# Altium schematic sheet BlockDiagram.SchDoc
size A3; SheetNumber: 1; SheetTotal: 3
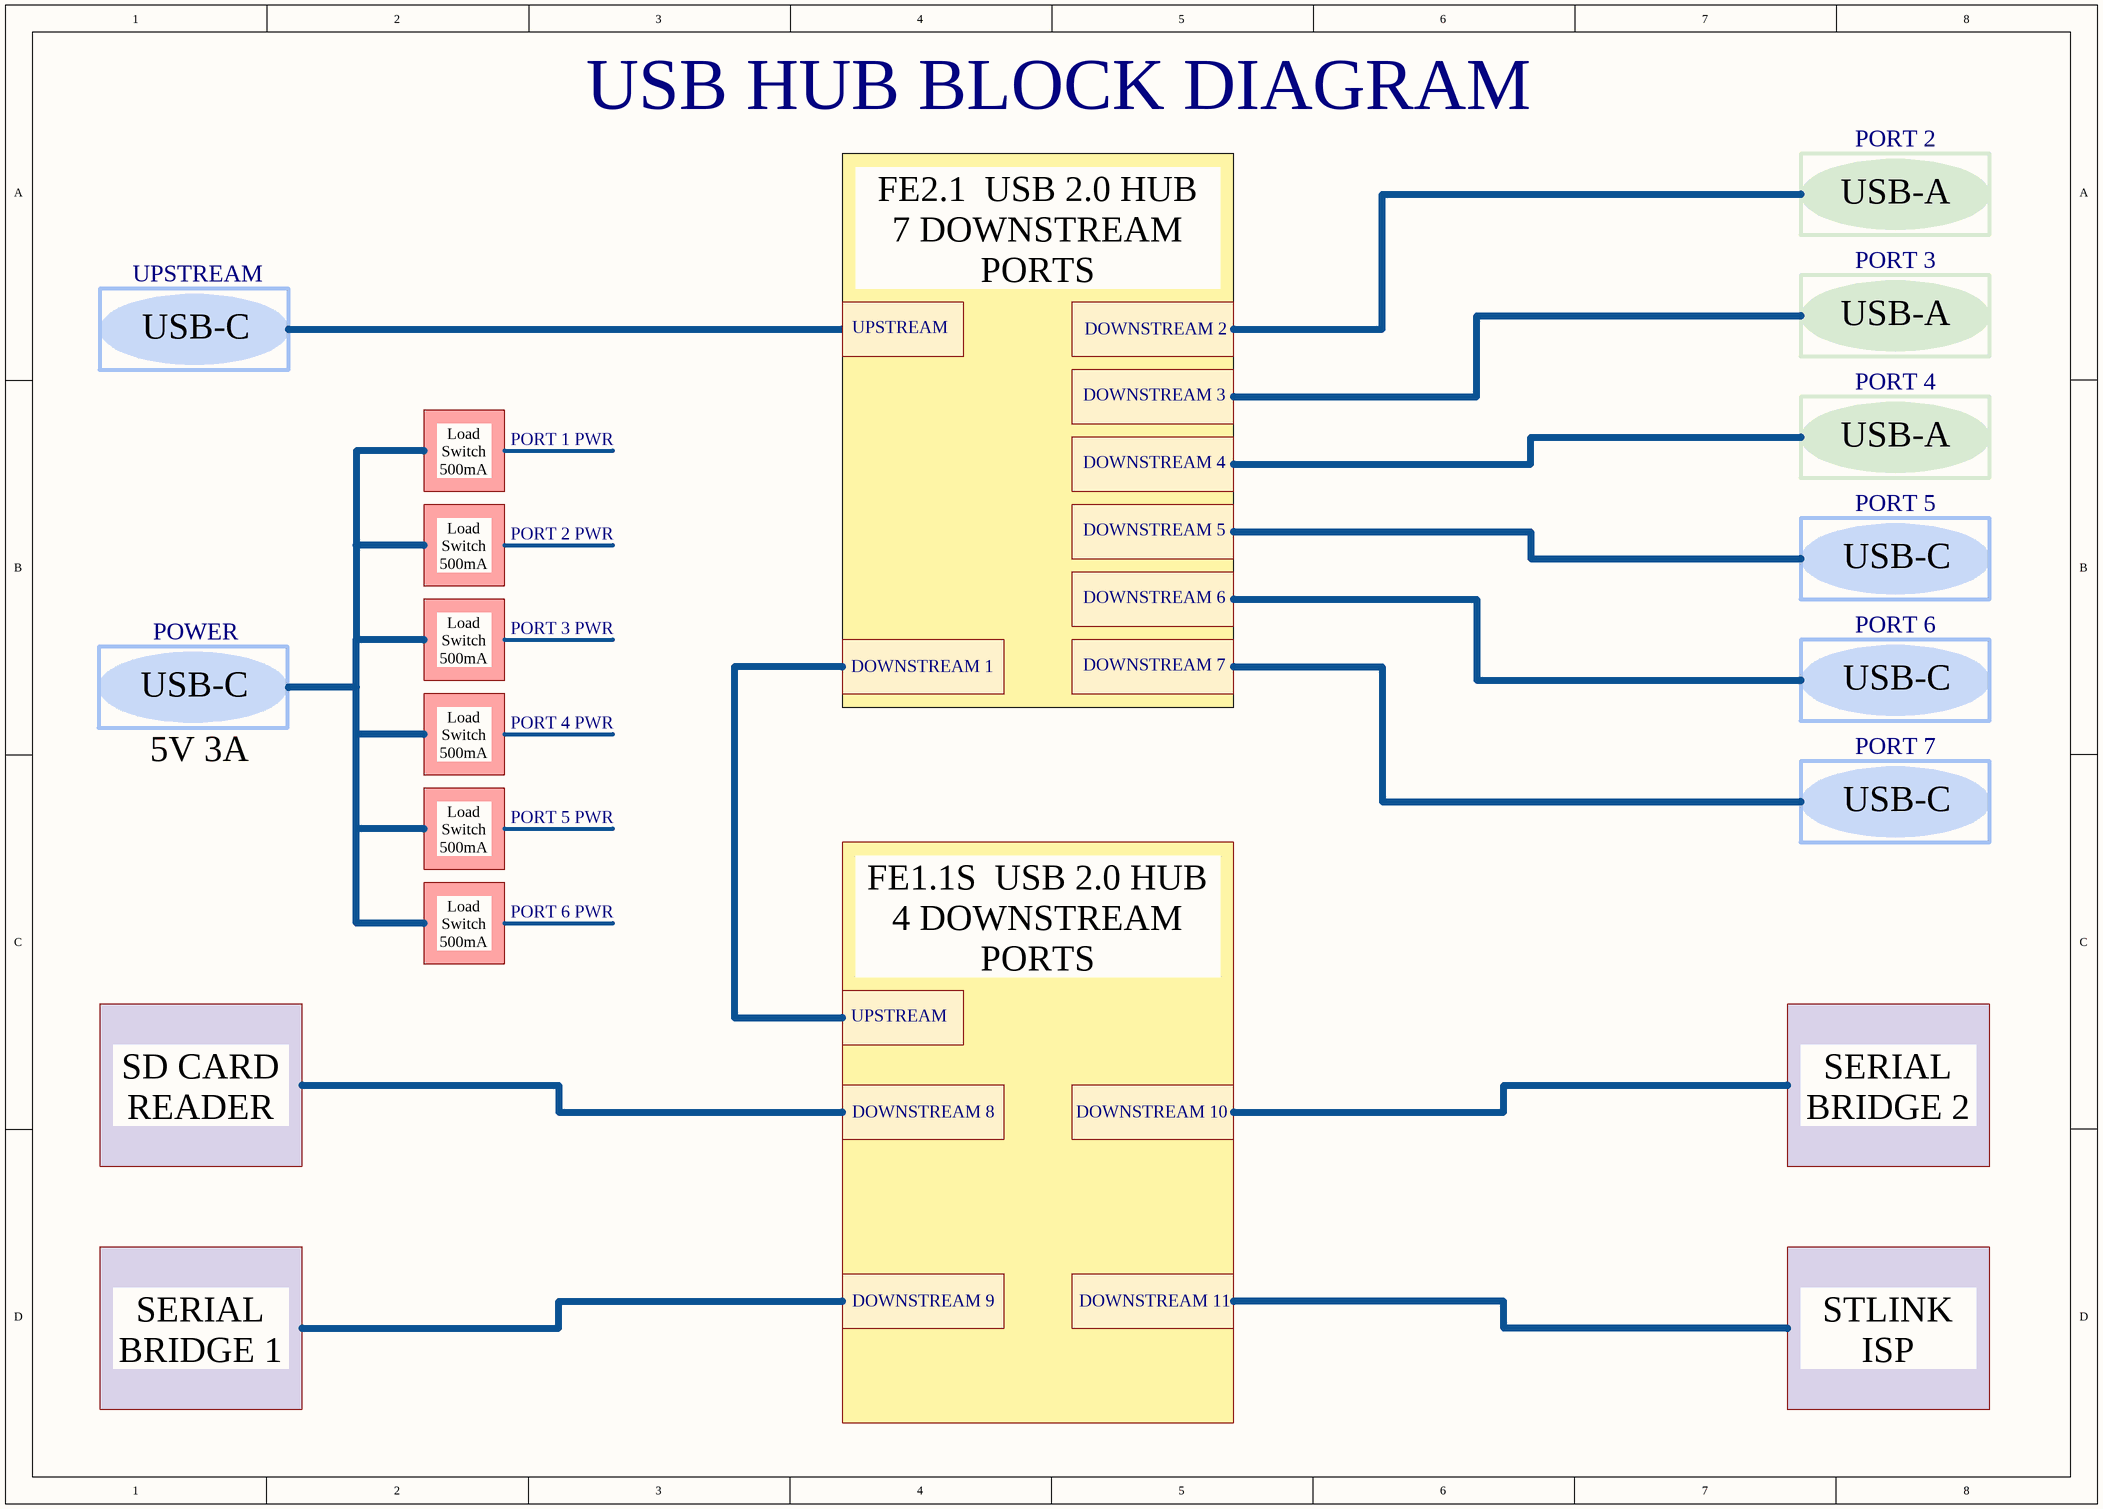
[diagram p0: BlockDiagram.SchDoc]

## Notes on the sheet
- USB HUB BLOCK DIAGRAM
- PORT 2
- USB-A
- UPSTREAM
- FE2.1  USB 2.0 HUB
  7 DOWNSTREAM
  PORTS
- PORT 3
- USB-C
- DOWNSTREAM 2
- PORT 1 PWR
- DOWNSTREAM 3
- PORT 4
- Load Switch
  500mA
- DOWNSTREAM 4
- PORT 5
- PORT 2 PWR
- DOWNSTREAM 5
- POWER
- PORT 3 PWR
- DOWNSTREAM 6
- PORT 6
- DOWNSTREAM 1
- DOWNSTREAM 7
- 5V 3A
- PORT 4 PWR
- PORT 7
- PORT 5 PWR
- PORT 6 PWR
- FE1.1S  USB 2.0 HUB
  4 DOWNSTREAM
  PORTS
- SD CARD
  READER
- DOWNSTREAM 8
- DOWNSTREAM 10
- SERIAL
  BRIDGE 2
- DOWNSTREAM 9
- DOWNSTREAM 11
- SERIAL
  BRIDGE 1
- STLINK
  ISP